# EAGLE schematic GPS_radiologger_v3 (EAGLE 9.5.1)
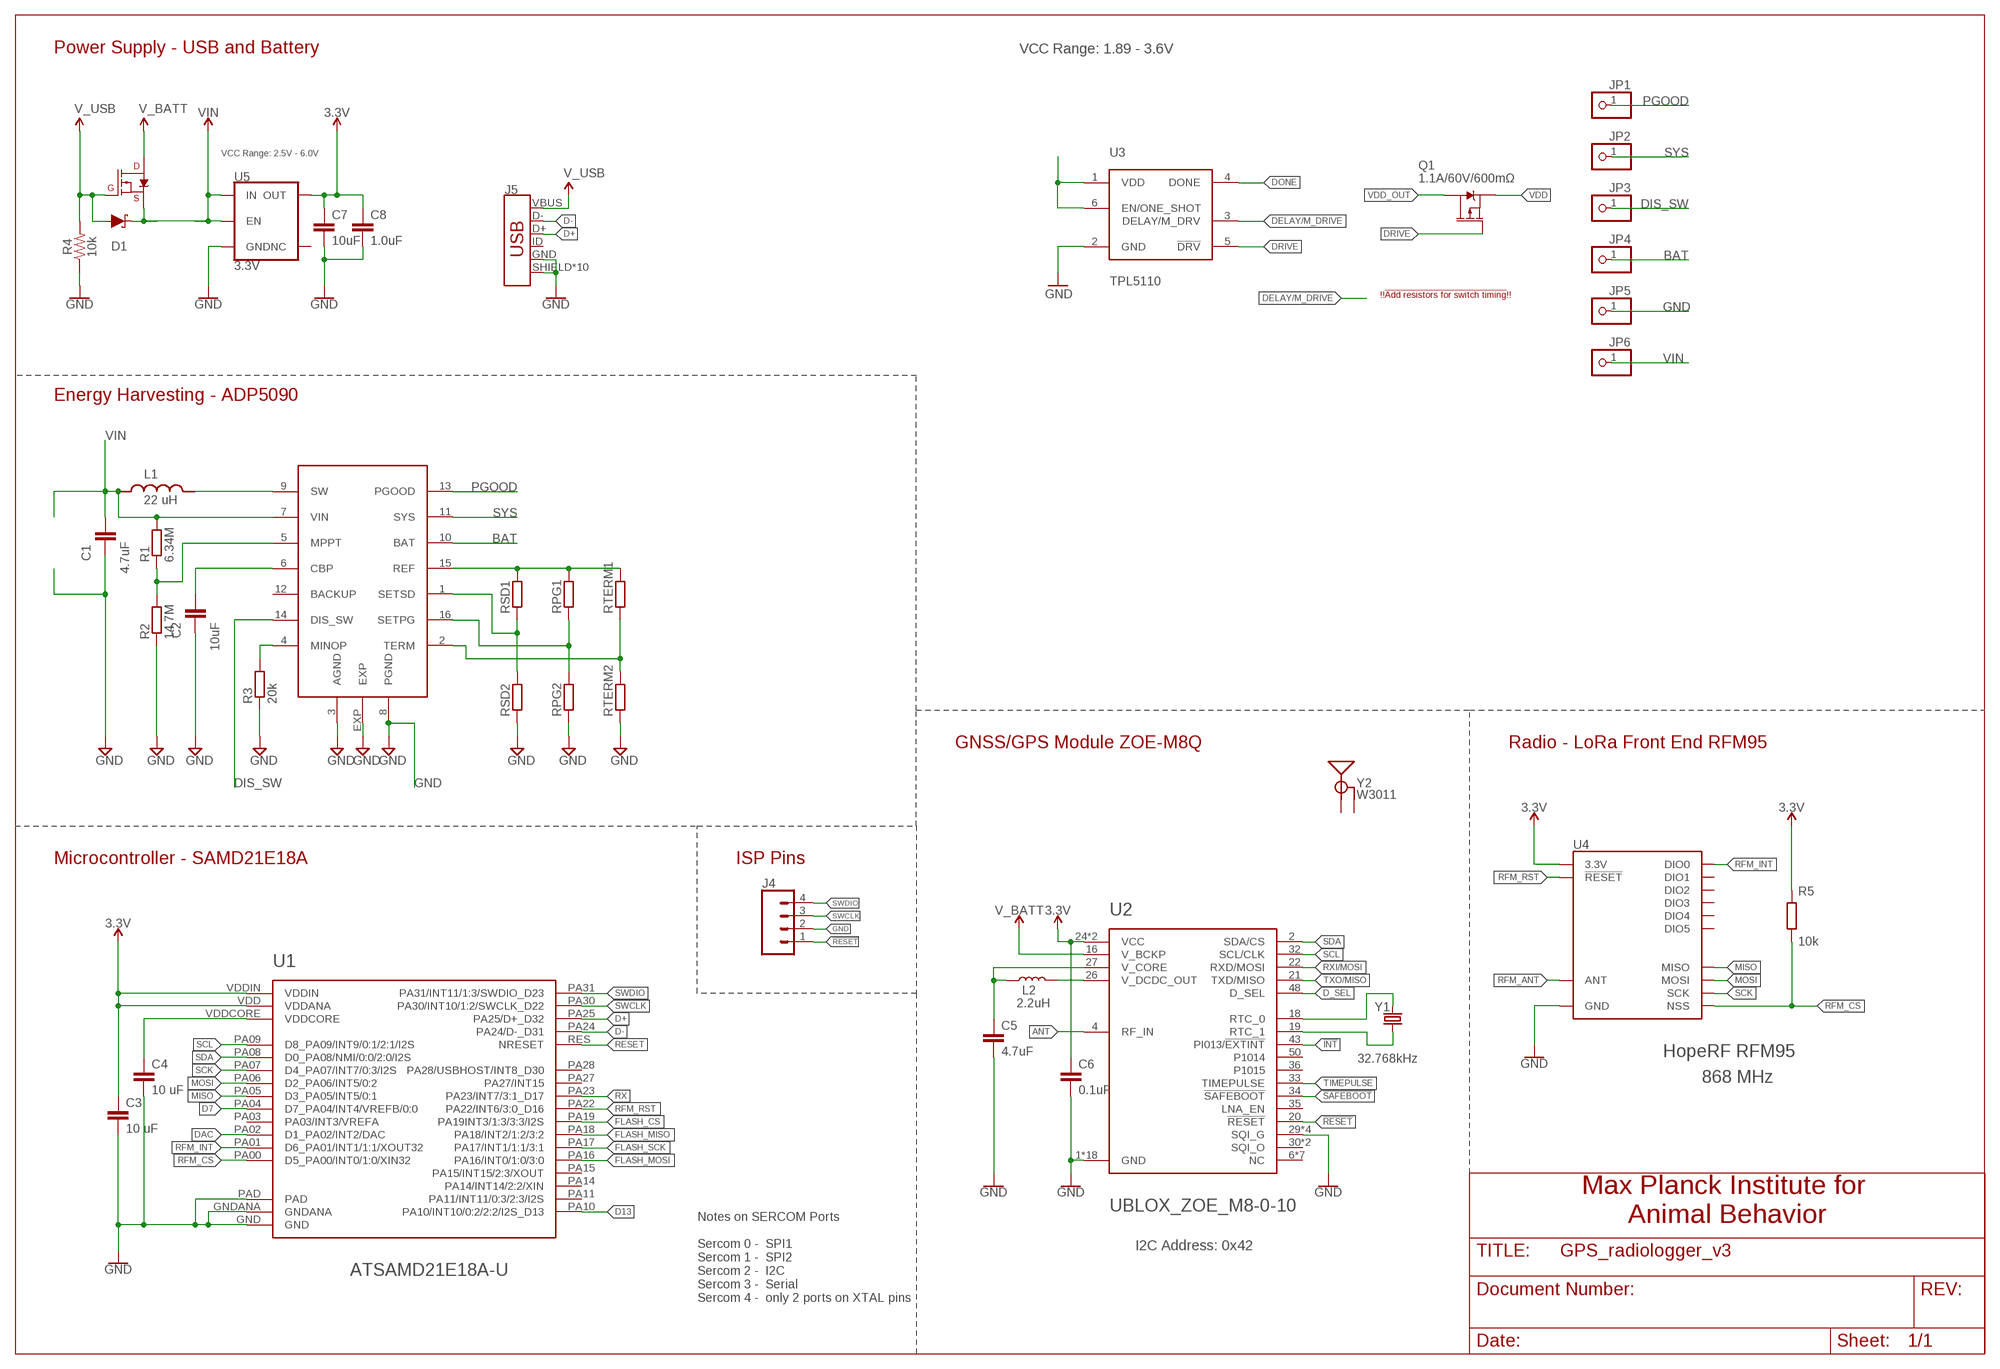
[diagram p0: schematic, sheet 1]

## Parts
C1  4.7uF  C-EUC0402  [C0402]
C2  10uF  C-EUC0402  [C0402]
C3  10 uF  C-EUC0201  [C0201]
C4  10 uF  C-EUC0201  [C0201]
C5  4.7uF  4.7UF-0603-6.3V-(10%)  [0603]
C6  0.1uF  0.1UF-0603-25V-(+80/-20%)  [0603]
C7  10uF  10UF-0603-6.3V-20%  [0603]
C8  1.0uF  1.0UF-0402-16V-10%  [0402]
D1  1A/23V/620mV  DIODE-SCHOTTKY-BAT20J  [SOD-323]
J4  CONN_041.27MM_NO_SILK  [1X04_1.27MM_NO_SILK]
J5  USB_MICRO-B_HALF_PTH_MILL  [USB-MICROB-PTH-MILL]
JP1  PINHD-1X1  [1X01]
JP2  PINHD-1X1  [1X01]
JP3  PINHD-1X1  [1X01]
JP4  PINHD-1X1  [1X01]
JP5  PINHD-1X1  [1X01]
JP6  PINHD-1X1  [1X01]
L1  22 uH  LPS4012-103MRB  [IND_LPS4012-103MRB]
L2  2.2uH  2.2μH_SHIELDED_INDUCTOR  [0806]
Q1  1.1A/60V/600mΩ  MOSFET_PCH-SI2309DS  [SOT23-3]
Q2  3.1A/30V/105mΩ  MOSFET_PCH-DMG2307L  [SOT23-3]
R1  6.34M  R-EU_R0201  [R0201]
R2  14.7M  R-EU_R0201  [R0201]
R3  20k  R-EU_R0201  [R0201]
R4  10k  10KOHM-0402-1/16W-1%  [0402]
R5  10k  R-EU_R0201  [R0201]
RPG1  R-EU_R0201  [R0201]
RPG2  R-EU_R0201  [R0201]
RSD1  R-EU_R0402  [R0402]
RSD2  R-EU_R0201  [R0201]
RTERM1  R-EU_R0402  [R0402]
RTERM2  R-EU_R0201  [R0201]
U1  ATSAMD21E18A-U  [QFN-32_SAMD]
U2  UBLOX_ZOE_M8-0-10  [UBLOX_ZOE_M8-0-10]
U3  TPL5110  [SOT23-6]
U4  RFM95W  [RFM95/96/97/98W]
U5  3.3V  V_REG_AP2112K-3.3V  [SOT23-5]
U$2  ADP5090  [LFCSP-16-3X3]
Y1  32.768kHz  CRYSTAL-32.768KHZSMD-3.2X1.5  [CRYSTAL-SMD-3.2X1.5MM]
Y2  W3011  GPS_CHIP_ANTENNAW3011  [W3011]

## Nets
3.3V: C3.1 C6.1 C7.1 C8.1 R5.2 U1.VDD(VDDANA) U1.VDDIN U2.24(VCC) U2.25(VCC) U4.3.3V U5.5(OUT)
!INT: U2.43(PI013/!EXTINT)
!RESET: J4.1 U2.20(!RESET)
!SAFEBOOT: U2.34(!SAFEBOOT)
ANT: U2.4(RF_IN)
BAT: JP4.1 U$2.10(BAT)
D7: U1.PA04(D7_PA04/INT4/VREFB/0:0)
D13: U1.PA10(PA10/INT10/0:2/2:2/I2S_D13)
D+: J5.D+ U1.PA25(PA25/D+_D32)
D-: J5.D- U1.PA24(PA24/D-_D31)
D_SEL: U2.48(D_SEL)
DAC: U1.PA02(D1_PA02/INT2/DAC)
DELAY/M_DRIVE: U3.3(DELAY/M_DRV)
DIS_SW: JP3.1 U$2.14(DIS_SW)
DONE: U3.4(DONE)
DRIVE: Q1.1(G) U3.5(!DRV)
FLASH_CS: U1.PA19(PA19INT3/1:3/3:3/I2S)
FLASH_MISO: U1.PA18(PA18/INT2/1:2/3:2)
FLASH_MOSI: U1.PA16(PA16/INT0/1:0/3:0)
FLASH_SCK: U1.PA17(PA17/INT1/1:1/3:1)
GND: C1.2 C2.2 C3.2 C4.2 C5.2 C6.2 C7.2 C8.2 J4.2 J5.GND J5.SHIELD J5.SHIELD2(SHIELD) J5.SHIELD3(SHIELD) J5.SHIELD4(SHIELD) J5.SHIELD5(SHIELD) J5.SHIELD6(SHIELD) J5.SHIELD7(SHIELD) J5.SHIELD8(SHIELD) J5.SHIELD9(SHIELD) J5.SHIELD10(SHIELD) JP5.1 R2.1 R3.1 R4.1 RPG2.1 RSD2.1 RTERM2.1 U1.GND U1.GNDANA U1.PAD U2.1(GND) U2.3(GND) U2.5(GND) U2.7(GND) U2.8(GND) U2.9(GND) U2.10(GND) U2.11(GND) U2.12(GND) U2.17(GND) U2.23(GND) U2.29(SQI_G) U2.31(SQI_G) U2.37(GND) U2.38(GND) U2.39(GND) U2.40(GND) U2.41(GND) U2.44(GND) U2.46(SQI_G) U2.47(SQI_G) U2.49(GND) U3.2(GND) U4.GND@1(GND) U4.GND@2(GND) U4.GND@3(GND) U5.2(GND) U$2.3(AGND) U$2.8(PGND) U$2.EXP
MISO: U1.PA05(D3_PA05/INT5/0:1) U4.MISO
MOSI: U1.PA06(D2_PA06/INT5/0:2) U4.MOSI
N$1: R1.1 R2.2 U$2.5(MPPT)
N$2: C2.1 U$2.6(CBP)
N$3: L1.2 U$2.9(SW)
N$4: L2.2 U2.26(V_DCDC_OUT)
N$5: R3.2 U$2.4(MINOP)
N$6: U3.1(VDD) U3.6(EN/ONE_SHOT)
N$7: RTERM1.1 RTERM2.2 U$2.2(TERM)
N$8: RPG1.1 RPG2.2 U$2.16(SETPG)
N$9: RSD1.1 RSD2.2 U$2.1(SETSD)
N$10: C4.1 U1.VDDCORE
N$11: RPG1.2 RSD1.2 RTERM1.2 U$2.15(REF)
N$13: C5.1 L2.1 U2.27(V_CORE)
N$14: U2.18(RTC_0) Y1.P$2
N$15: U2.19(RTC_1) Y1.P$1
PGOOD: JP1.1 U$2.13(PGOOD)
RESET: U1.RES(NRESET)
RFM_ANT: U4.ANT
RFM_CS: R5.1 U1.PA00(D5_PA00/INT0/1:0/XIN32) U4.NSS
RFM_INT: U1.PA01(D6_PA01/INT1/1:1/XOUT32) U4.DIO0
RFM_RST: U1.PA22(PA22/INT6/3:0_D16) U4.!RESET
RX: U1.PA23(PA23/INT7/3:1_D17)
RXI/MOSI: U2.22(RXD/MOSI)
SCK: U1.PA07(D4_PA07/INT7/0:3/I2S) U4.SCK
SCL: U1.PA09(D8_PA09/INT9/0:1/2:1/I2S) U2.32(SCL/CLK)
SDA: U1.PA08(D0_PA08/NMI/0:0/2:0/I2S) U2.2(SDA/CS)
SWCLK: J4.3 U1.PA30(PA30/INT10/1:2/SWCLK_D22)
SWDIO: J4.4 U1.PA31(PA31/INT11/1:3/SWDIO_D23)
SYS: JP2.1 U$2.11(SYS)
TIMEPULSE: U2.33(TIMEPULSE)
TXO/MISO: U2.21(TXD/MISO)
V_BATT: Q2.3(D) U2.16(V_BCKP)
V_USB: D1.A J5.VBUS Q2.1(G) R4.2
VDD: Q1.2(S)
VDD_OUT: Q1.3(D)
VIN: C1.1 D1.C JP6.1 L1.1 Q2.2(S) R1.2 U5.1(IN) U5.3(EN) U$2.7(VIN)
Unconnected: J5.ID U1.PA03(PA03/INT3/VREFA) U1.PA11(PA11/INT11/0:3/2:3/I2S) U1.PA14(PA14/INT14/2:2/XIN) U1.PA15(PA15/INT15/2:3/XOUT) U1.PA27(PA27/INT15) U1.PA28(PA28/USBHOST/INT8_D30) U2.6(NC) U2.13(NC) U2.14(NC) U2.15(NC) U2.28(NC) U2.30(SQI_O) U2.35(LNA_EN) U2.36(P1015) U2.42(NC) U2.45(SQI_O) U2.50(P1014) U2.51(NC) U4.DIO1 U4.DIO2 U4.DIO3 U4.DIO4 U4.DIO5 U5.4(NC) U$2.12(BACKUP) Y2.1(SIGNAL) Y2.2(GND) Y2.3(GND)

## Notes on the sheet
- Power Supply - USB and Battery | VCC Range: 1.89 - 3.6V
- VCC Range: 2.5V - 6.0V
- !!!Add resistors for switch timing!!!
- Energy Harvesting - ADP5090
- GNSS/GPS Module ZOE-M8Q | Radio - LoRa Front End RFM95
- Microcontroller - SAMD21E18A | ISP Pins
- HopeRF RFM95
- 868 MHz
- Max Planck Institute for 
  Animal Behavior
- I2C Address: 0x42
- Notes on SERCOM Ports
  
  Sercom 0 -  SPI1
  Sercom 1 -  SPI2
  Sercom 2 -  I2C
  Sercom 3 -  Serial
  Sercom 4 -  only 2 ports on XTAL pins

## Library data of the parts
C1 C2 = resistor:C-EU: CAPACITOR, European symbol
C3 C4 = rcl:C-EU: CAPACITOR, European symbol; SPICEPREFIX: C
C5 = SparkFun-Capacitors:4.7UF: 4.7µF ceramic capacitors A capacitor is a passive two-terminal electrical component used to store electrical energy temporarily in an electric field.; PROD_ID: CAP-08280
C6 = SparkFun-Capacitors:0.1UF: 0.1µF ceramic capacitors A capacitor is a passive two-terminal electrical component used to store electrical energy temporarily in an electric field.; PROD_ID: CAP-00810
C7 = SparkFun-Capacitors:10UF: 10.0µF ceramic capacitors A capacitor is a passive two-terminal electrical component used to store electrical energy temporarily in an electric field.; PROD_ID: CAP-11015
C8 = SparkFun-Capacitors:1.0UF: 1µF ceramic capacitors A capacitor is a passive two-terminal electrical component used to store electrical energy temporarily in an electric field.; PROD_ID: CAP-12417
D1 = SparkFun-DiscreteSemi:DIODE-SCHOTTKY: Schottky diode A Schottky diode is a semiconductor diode which has a low forward voltage drop and a very fast switching action.; PROD_ID: DIO-11623
J4 = SparkFun-Connectors:CONN_04: Multi connection point. Often used as Generic Header-pin footprint for 0.1 inch spaced/style header connections On any of the 0.1 inch spaced packages, you can populate with these: Break Away Headers - Straight <https://www.sparkfun.com/products/116> (PRT-00116) Break Away Male Headers - Right Angle <https://www.sparkfun.com/products/553> (PRT-00553) Female Headers <https://www.sparkfun.com/products/115> (PRT-00115) Break Away Headers - Machine Pin <https://www.sparkfun.com/products/117> (PRT-00117) Break Away Female Headers - Swiss Machine Pin <https://www.sparkfun.com/products/743> (PRT-00743) For SCREWTERMINALS and SPRING TERMINALS visit here: Screw Terimnals on SparkFun.com <https://www.sparkfun.com/search/results?term=Screw+Terminals> (5mm/3.5mm/2.54mm spacing) This device is also useful as a general connection point to wire up your design to another part of your project. Our various solder wires solder well into these plated through hole pads. Hook-Up Wire - Assortment (Stranded, 22 AWG) <https://www.sparkfun.com/products/11375> (PRT-11375) Hook-Up Wire - Assortment (Solid Core, 22 AWG) <https://www.sparkfun.com/products/11367> (PRT-11367) View the entire wire category on our website here <https://www.sparkfun.com/categories/141> Special notes: Molex polarized connector foot print use with SKU : PRT-08231 with associated crimp pins and housings. 1MM SMD Version SKU: PRT-10208
J5 = SparkFun-Connectors:USB_MICRO-B: USB Type Micro-B Connector Male/female and PTH/SMT variants SparkFun Products: SparkFun microB USB Breakout <https://www.sparkfun.com/products/12035> SparkFun USB microB Plug Breakout <https://www.sparkfun.com/products/10031> SparkFun ESP8266 Thing <https://www.sparkfun.com/products/13231>; PROD_ID: CONN-13711
JP1-JP6 = pinhead:PINHD-1X1: PIN HEADER
L1 = LPS4012-103MRB:LPS4012-103MRB: Power inductor, shielded, 20/30% tol, SMT, RoHS, lead-free, halogen-free; AVAILABILITY: Unavailable; DESCRIPTION: Power inductor, shielded, 20/30% tol, SMT, RoHS, lead-free, halogen-free; MF: Coilcraft; MP: LPS4012-103MRB; PACKAGE: None; PRICE: None
L2 = SparkFun-Coils:2.2μH_SHIELDED_INDUCTOR: Murata 2.2uH Inductor 2.2uH 1.2A 110mOhm 0806 Package Shielded; PROD_ID: NDUC-14257
Q1 = SparkFun-DiscreteSemi:MOSFET_PCH: P-channel MOSFETs Voltage controlled devices that allow control of high current outputs. SparkFun Products: SparkFun ESP32 Thing <https://www.sparkfun.com/products/13907> SparkFun ESP8266 Thing <https://www.sparkfun.com/products/13231>; PROD_ID: TRANS-08285
Q2 = SparkFun-DiscreteSemi:MOSFET_PCH: P-channel MOSFETs Voltage controlled devices that allow control of high current outputs. SparkFun Products: SparkFun ESP32 Thing <https://www.sparkfun.com/products/13907> SparkFun ESP8266 Thing <https://www.sparkfun.com/products/13231> SparkFun Pi Servo HAT V2 <https://www.sparkfun.com/products/15316> DMG2305UX-7 (20V/4.2A/SOT23-3); PROD_ID: TRANS-11308
R1-R3 RPG1 RPG2 RSD2 RTERM2 = resistor:R-EU_: RESISTOR, European symbol
R4 = SparkFun-Resistors:10KOHM: 10kΩ resistor A resistor is a passive two-terminal electrical component that implements electrical resistance as a circuit element. Resistors act to reduce current flow, and, at the same time, act to lower voltage levels within circuits. - Wikipedia; PROD_ID: RES-14241
R5 RSD1 RTERM1 = rcl:R-EU_: RESISTOR, European symbol; SPICEPREFIX: R
U1 = SparkFun-IC-Microcontroller:ATSAMD21E18A-U: SAM D21E 32-Pin QFN The SAMD21E is built around the 32-bit ARM Cortex-M0+ processor with up to 256KB of Flash and 32KB of SRAM. It operates at a maximum frequency of 48MHz.; PROD_ID: IC-14428
U2 = SparkFun-GPS:UBLOX_ZOE_M8-0-10: UBLOX ZOE-M8Q-0-10 u-blox ZOE-M8 standard precision GNSS SiP (System in Package) modules feature the high performance u-blox M8 GNSS engine. ZOE-M8’s ultra-miniature form factor integrates a complete GNSS receiver including SAW filter, LNA and TCXO. Handles all GNSS systems and can simulatenously use up to three of them, with accuracy ranging from 2.5m to 4m. GPS GLONASS BeiDou Galileo This can be corrected with the SBAS or QZSS augmentation systems.; PROD_ID: IC-14251
U3 = SparkFun-IC-Power:TPL5110: TPL5110 Nano-Power System Timer for Power Gating The TPL5110 Nano Timer is a low power timer with an integrated MOSFET driver designed for power gating in duty cycled or battery-powered applications. Consuming only 35 nA, the TPL5110 can enable the power supply line and drastically reduce the overall system stand by current during the sleep time.; PROD_ID: IC-14387
U4 = SparkFun-RF:RFM95W: RFM95/96/97/98 The RFM95/96/97/98(W) transceivers feature the LoRaTM long range modem that provides ultra-long range spread spectrum communication and high interference immunity whilst minimising current consumption. These devices also support high performance (G)FSK modes for systems including WMBus, IEEE802.15.4g. The RFM95/96/97/98(W) deliver exceptional phase noise, selectivity, receiver linearity and IIP3 for significantly lower current consumption than competing devices Datasheet <http://www.hoperf.com/upload/rf/RFM95_96_97_98W.pdf>; PROD_ID: IC-13959
U5 = SparkFun-IC-Power:V_REG_AP2112: AP2112 - 600mA CMOS LDO Regulator w/ Enable The AP2112 is CMOS process low dropout linear regulator with enable function, the regulator delivers a guaranteed 600mA (min.) continuous load current. Features Output Voltage Accuracy: ±1.5% Output Current: 600mA (Min.) Foldback Short Current Protection: 50mA Enable Function to Turn ON/OFF VOUT Low Dropout Voltage (3.3V): 250mV (Typ.) @IOUT=600mA Excellent Load Regulation: 0.2%/A (Typ.) Excellent Line Regulation: 0.02%/V (Typ.) Low Quiescent Current: 55μA (Typ.) Low Standby Current: 0.01μA (Typ.) Low Output Noise: 50μVRMS PSRR: 100Hz -65dB, 1kHz -65dB OTSD Protection Stable with 1.0μF Flexible Cap: Ceramic, Tantalum and Aluminum Electrolytic Operation Temperature Range: -40°C to 85°C ESD: MM 400V, HBM 4000V; PROD_ID: VREG-12457
U$2 = ADP5090_LFCSP-16-3X3:ADP5090
Y1 = SparkFun-Clocks:CRYSTAL-32.768KHZ: 32.768kHz Crystal Frequency: 32.768kHz Frequency Stability: ±20ppm Load Capacitance: 12.5pF (PTH-2X6 & SMD-3.2X1.5), 6pF (SMD-2X6) SparkFun Products: SparkFun BigTime Watch Kit <https://www.sparkfun.com/products/11734> SparkFun nRF52832 Breakout <https://www.sparkfun.com/products/13990> SparkFun Real Time Clock Module <https://www.sparkfun.com/products/12708>; PROD_ID: XTAL-13062
Y2 = SparkFun-GPS:GPS_CHIP_ANTENNA; PROD_ID: ANT-14304

## Net classes
0 default: width 0 mm, drill 0 mm
1 vcc: width 0 mm